# EasyEDA Pro project ProDocument_N64 SpyDVI_2024-08-21.epro

# Schematic Schematic
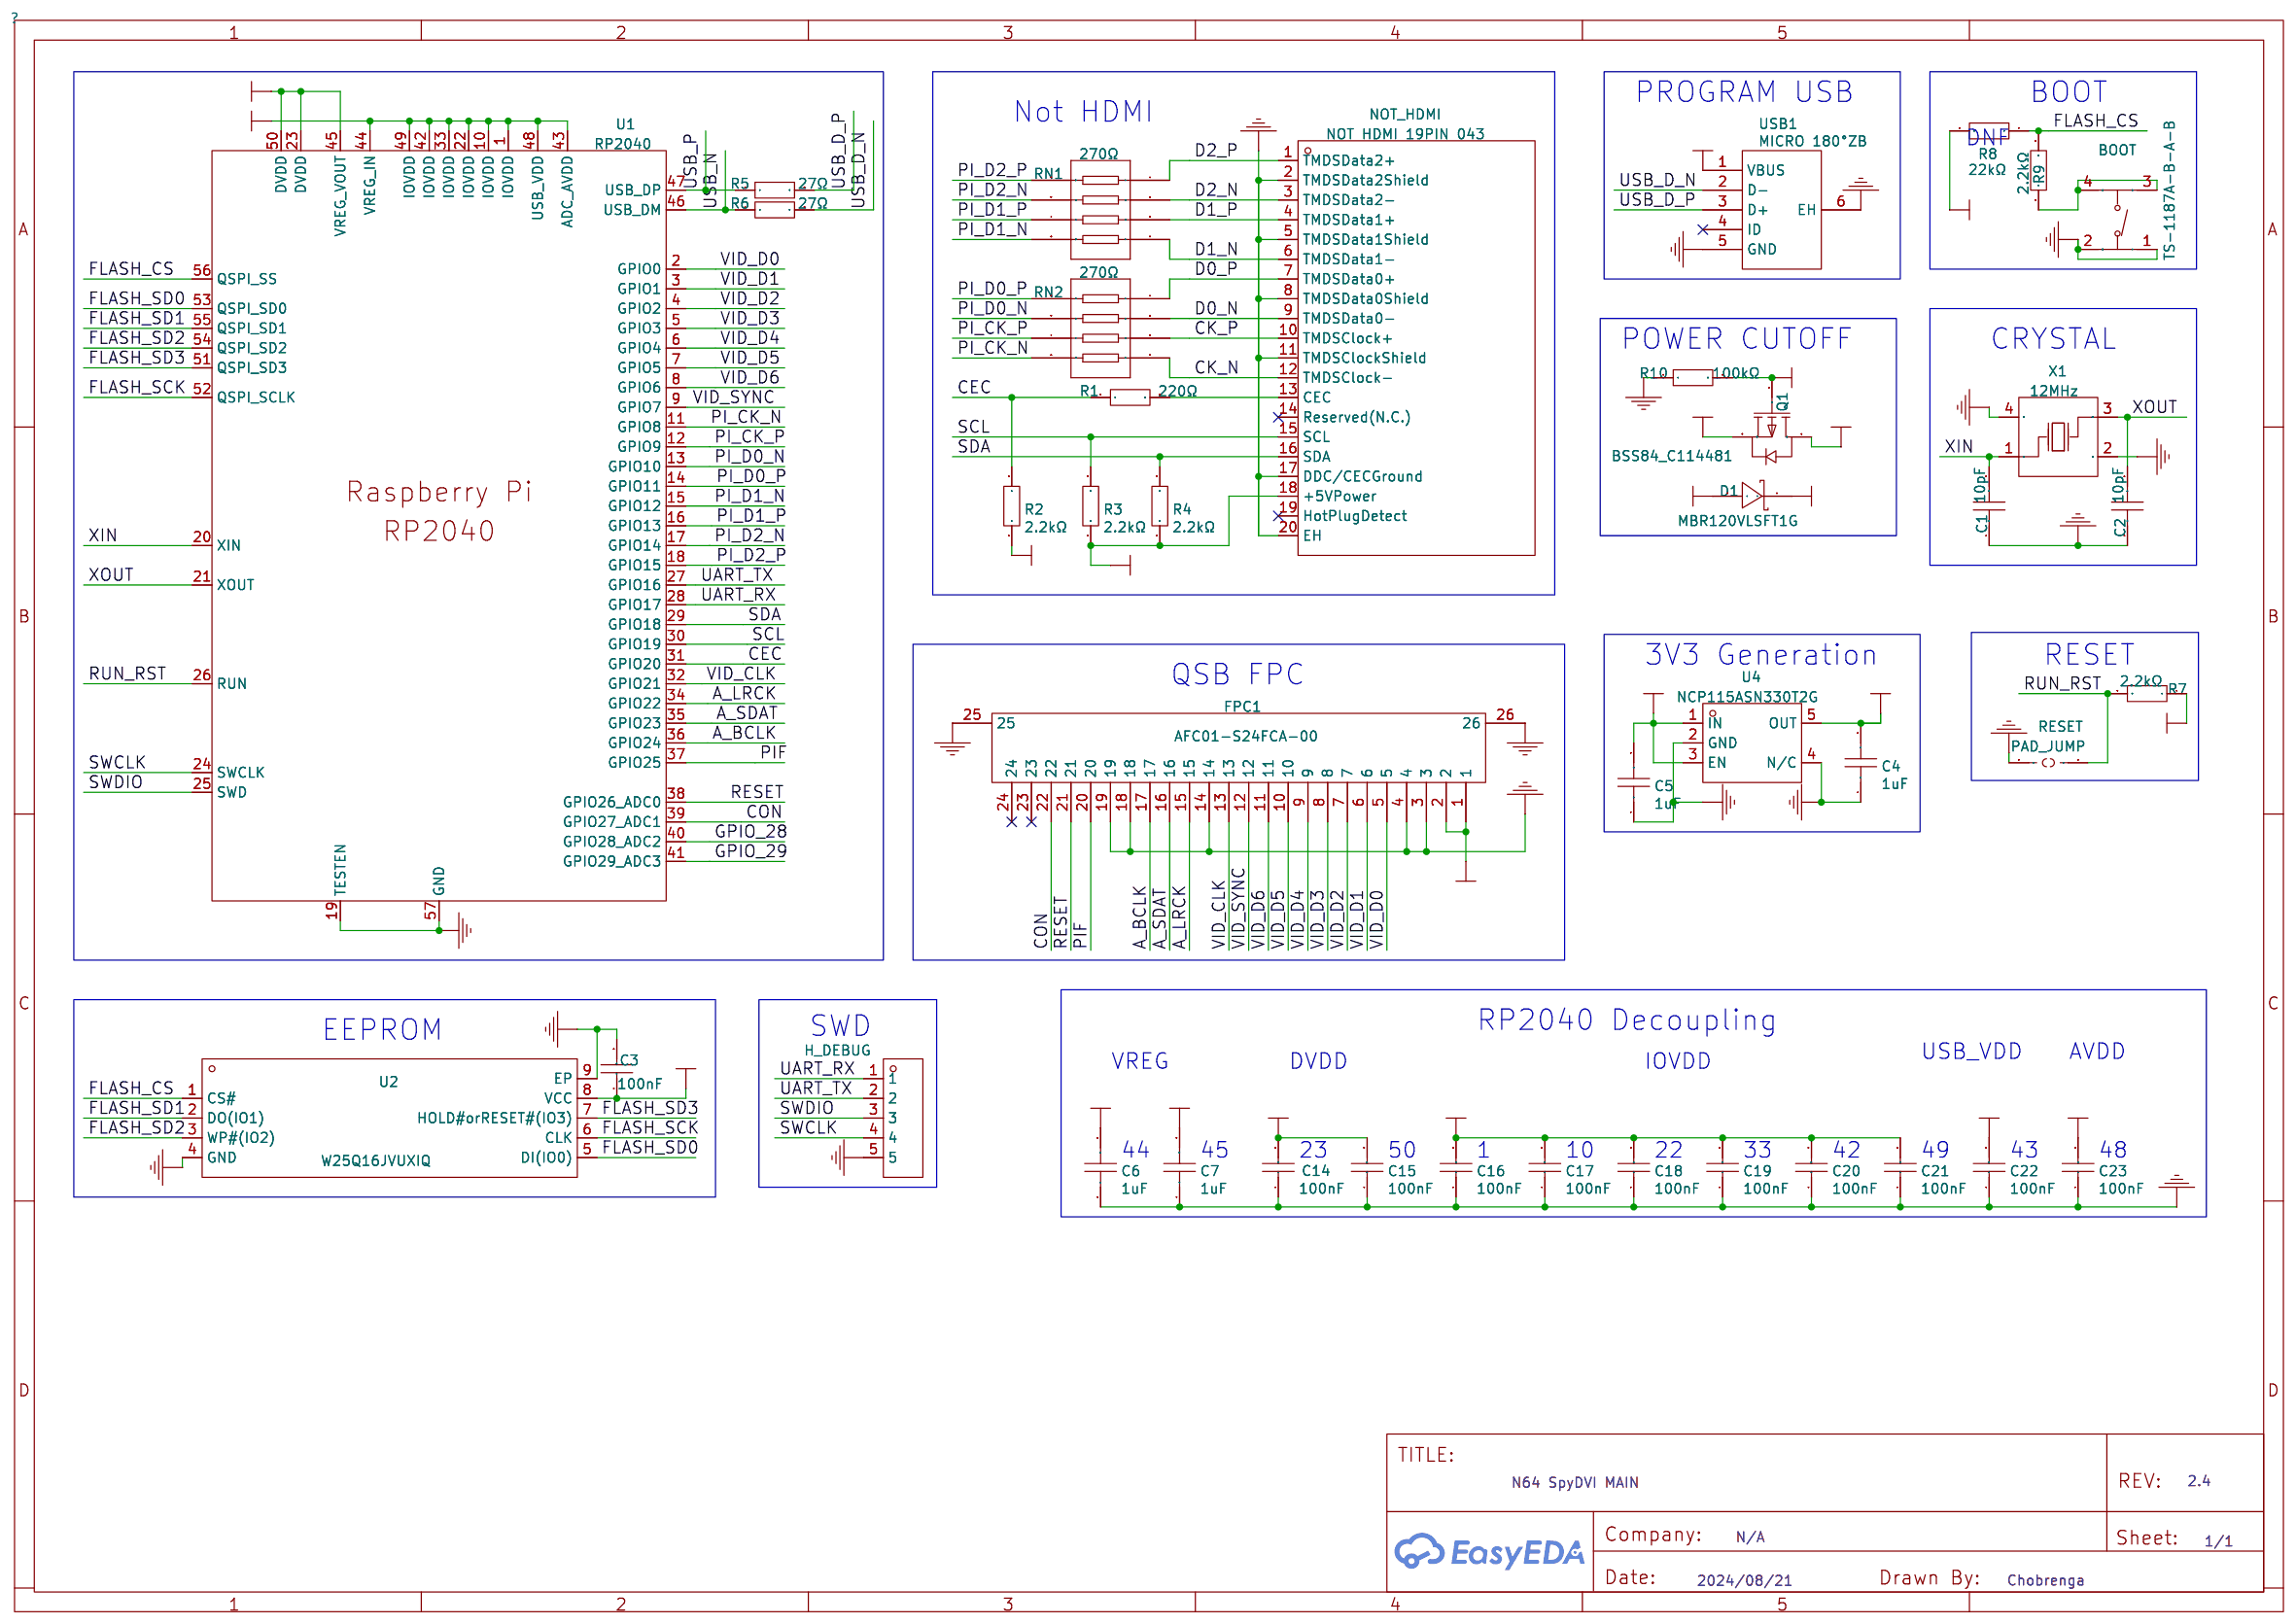
[diagram p0: schematic sheet]

## Parts
BOOT  TS-1187A-B-A-B  [SW-SMD_4P-L5.1-W5.1-P3.70-LS6.5-TL-2]
C1  10pF  [C0402]
C2  10pF  [C0402]
C3  100nF  [C0402]
C4  1uF  [C0402]
C5  1uF  [C0402]
C6  1uF  [C0402]
C7  1uF  [C0402]
C14  100nF  [C0402]
C15  100nF  [C0402]
C16  100nF  [C0402]
C17  100nF  [C0402]
C18  100nF  [C0402]
C19  100nF  [C0402]
C20  100nF  [C0402]
C21  100nF  [C0402]
C22  100nF  [C0402]
C23  100nF  [C0402]
D1  MBR120VLSFT1G  [SOD-123F_L2.8-W1.8-LS3.7-RD]
FPC1  AFC01-S24FCA-00  [FPC-SMD_P0.50-24P_FGS-XJ-H2.0]
H_DEBUG  PZ254V-11-05P  [HDR-TH_5P-P2.54-V-M]
NOT_HDMI  NOT HDMI 19PIN 043  [HDMI-SMD_HDMI-19PIN-043]
Q1  BSS84_C114481  [SOT-23-3_L2.9-W1.6-P1.90-LS2.8-BR]
R1  220Ω  [R0402]
R2  2.2kΩ  [R0402]
R3  2.2kΩ  [R0402]
R4  2.2kΩ  [R0402]
R5  27Ω  [R0402]
R6  27Ω  [R0402]
R7  2.2kΩ  [R0402]
R8  22kΩ  [R0402]  (no BOM)
R9  2.2kΩ  [R0402]
R10  100kΩ  [R0402]
RESET  PAD_JUMP  [PAD-JUMPER-2-NO_NO_SILK]  (no BOM)
RN1  270Ω  [RES-ARRAY-SMD_0804-8P-L2.0-W1.0-BL]
RN2  270Ω  [RES-ARRAY-SMD_0804-8P-L2.0-W1.0-BL]
U1  RP2040  [LQFN-56_L7.0-W7.0-P0.4-EP]
U2  W25Q16JVUXIQ  [USON-8_L3.0-W2.0-P0.50-BL-EP]
U4  NCP115ASN330T2G  [SOT-23-5_L3.0-W1.7-P0.95-LS2.8-BL]
USB1  MICRO 180°ZB  [MICRO-USB-TH_MICRO-180-ZB]
X1  12MHz  [CRYSTAL-SMD_4P-L3.2-W2.5-BL]

## Library data of the parts
BOOT = TS-1187A-B-A-B: Supplier: LCSC; Supplier Part: C318884; Manufacturer: XKB Connectivity(中国星坤); JLCPCB Part Class: Basic Part
C1 C2 = 10pF: Supplier: LCSC; Manufacturer: SAMSUNG(三星); Manufacturer Part: CL05C100JB5NNNC; Supplier Part: C32949; JLCPCB Part Class: Basic Part
C3 C14-C23 = 100nF: Supplier: LCSC; Manufacturer Part: CL05B104KO5NNNC; Manufacturer: SAMSUNG(三星); Supplier Part: C1525; JLCPCB Part Class: Basic Part
C4-C7 = 1uF: Supplier: LCSC; Manufacturer: SAMSUNG(三星); Manufacturer Part: CL05A105KA5NQNC; Supplier Part: C52923; JLCPCB Part Class: Basic Part
D1 = MBR120VLSFT1G: Supplier: LCSC; Supplier Part: C223608; Manufacturer: onsemi(安森美); JLCPCB Part Class: Extended Part
FPC1 = AFC01-S24FCA-00: Supplier: LCSC; Supplier Part: C262669; Manufacturer: JS(钜硕电子); JLCPCB Part Class: Extended Part
H_DEBUG = PZ254V-11-05P: Supplier: LCSC; Supplier Part: C492404; Manufacturer: XFCN(兴飞); JLCPCB Part Class: Extended Part
NOT_HDMI = NOT HDMI 19PIN 043: Supplier: LCSC; Supplier Part: C2858275; Manufacturer: SHOU HAN(首韩); Manufacturer Part: HDMI 19PIN 043; JLCPCB Part Class: Extended Part
Q1 = BSS84_C114481: Supplier: LCSC; Manufacturer: CJ(江苏长电/长晶); Manufacturer Part: BSS84; Supplier Part: C114481; JLCPCB Part Class: Extended Part
R1 = 220Ω: Supplier: LCSC; Manufacturer: UNI-ROYAL(厚声); Manufacturer Part: 0402WGF2200TCE; Supplier Part: C25091; JLCPCB Part Class: Basic Part
R2-R4 R7 R9 = 2.2kΩ: Supplier: LCSC; Manufacturer: UNI-ROYAL(厚声); Manufacturer Part: 0402WGF2201TCE; Supplier Part: C25879; JLCPCB Part Class: Basic Part
R5 R6 = 27Ω: Supplier: LCSC; Manufacturer: UNI-ROYAL(厚声); Manufacturer Part: 0402WGF270JTCE; Supplier Part: C25100; JLCPCB Part Class: Extended Part
R8 = 22kΩ
R10 = 100kΩ: Supplier: LCSC; Manufacturer: UNI-ROYAL(厚声); Manufacturer Part: 0402WGF1003TCE; Supplier Part: C25741; JLCPCB Part Class: Basic Part
RESET = PAD_JUMP
RN1 RN2 = 270Ω: Supplier: LCSC; Supplier Part: C148510; Manufacturer: BOURNS; Manufacturer Part: CAT10-271J4LF; JLCPCB Part Class: Extended Part
U1 = RP2040: Supplier: LCSC; Supplier Part: C2040; Manufacturer: Raspberry Pi(树莓派); JLCPCB Part Class: Extended Part
U2 = W25Q16JVUXIQ: Supplier: LCSC; Supplier Part: C2843335; Manufacturer: WINBOND(华邦); JLCPCB Part Class: Extended Part
U4 = NCP115ASN330T2G: Supplier: LCSC; Supplier Part: C603505; Manufacturer: onsemi(安森美); JLCPCB Part Class: Extended Part
USB1 = MICRO 180°ZB: Supplier: LCSC; Supplier Part: C668588; Manufacturer: SHOU HAN(首韩); JLCPCB Part Class: Extended Part
X1 = 12MHz: Supplier: LCSC; Manufacturer: YXC(扬兴晶振); Manufacturer Part: X322512MMB4SI; Supplier Part: C50430; JLCPCB Part Class: Extended Part

## Nets
+1V1: C7.2 C14.2 C15.2 U1.23(DVDD) U1.45(VREG_VOUT) U1.50(DVDD)
+3V3: C3.1 C4.2 C6.2 C16.2 C17.2 C18.2 C19.2 C20.2 C21.2 C22.2 C23.2 R2.1 R7.1 R8.2 U1.1(IOVDD) U1.10(IOVDD) U1.22(IOVDD) U1.33(IOVDD) U1.42(IOVDD) U1.43(ADC_AVDD) U1.44(VREG_IN) U1.48(USB_VDD) U1.49(IOVDD) U2.8(VCC) U4.5(OUT)
+5V_N64: FPC1.1 FPC1.2 Q1.3(D)
+VBUS: D1.2(A) Q1.1(G) R10.2 USB1.1(VBUS)
GND: BOOT.1(A) BOOT.2(B) C1.1 C2.1 C3.2 C4.1 C5.1 C6.1 C7.1 C14.1 C15.1 C16.1 C17.1 C18.1 C19.1 C20.1 C21.1 C22.1 C23.1 FPC1.3 FPC1.4 FPC1.14 FPC1.18 FPC1.19 FPC1.25 FPC1.26 H_DEBUG.5 NOT_HDMI.2(TMDSData2Shield) NOT_HDMI.5(TMDSData1Shield) NOT_HDMI.8(TMDSData0Shield) NOT_HDMI.11(TMDSClockShield) NOT_HDMI.17(DDC/CECGround) NOT_HDMI.20(EH) R10.1 RESET.1 U1.19(TESTEN) U1.57(GND) U2.4(GND) U2.9(EP) U4.2(GND) U4.4(N/C) USB1.5(GND) USB1.6(EH) X1.2(GND) X1.4(GND)
+VSYS: C5.2 D1.1(K) NOT_HDMI.18(+5VPower) Q1.2(S) R3.1 R4.1 U4.1(IN) U4.3(EN)
A_BCLK: FPC1.17 U1.36(GPIO24)
A_LRCK: FPC1.15 U1.34(GPIO22)
A_SDAT: FPC1.16 U1.35(GPIO23)
CEC: R1.1 R2.2 U1.31(GPIO20)
CK_N: NOT_HDMI.12(TMDSClock-) RN2.1
CK_P: NOT_HDMI.10(TMDSClock+) RN2.2
CON: FPC1.22 U1.39(GPIO27_ADC1)
D0_N: NOT_HDMI.9(TMDSData0-) RN2.3
D0_P: NOT_HDMI.7(TMDSData0+) RN2.4
D1_N: NOT_HDMI.6(TMDSData1-) RN1.1
D1_P: NOT_HDMI.4(TMDSData1+) RN1.2
D2_N: NOT_HDMI.3(TMDSData2-) RN1.3
D2_P: NOT_HDMI.1(TMDSData2+) RN1.4
FLASH_CS: R8.1 R9.2 U1.56(QSPI_SS) U2.1(CS#)
FLASH_SCK: U1.52(QSPI_SCLK) U2.6(CLK)
FLASH_SD0: U1.53(QSPI_SD0) U2.5(DI(IO0))
FLASH_SD1: U1.55(QSPI_SD1) U2.2(DO(IO1))
FLASH_SD2: U1.54(QSPI_SD2) U2.3(WP#(IO2))
FLASH_SD3: U1.51(QSPI_SD3) U2.7(HOLD#orRESET#(IO3))
GPIO_28: U1.40(GPIO28_ADC2)
GPIO_29: U1.41(GPIO29_ADC3)
PI_CK_N: RN2.8 U1.11(GPIO8)
PI_CK_P: RN2.7 U1.12(GPIO9)
PI_D0_N: RN2.6 U1.13(GPIO10)
PI_D0_P: RN2.5 U1.14(GPIO11)
PI_D1_N: RN1.8 U1.15(GPIO12)
PI_D1_P: RN1.7 U1.16(GPIO13)
PI_D2_N: RN1.6 U1.17(GPIO14)
PI_D2_P: RN1.5 U1.18(GPIO15)
PIF: FPC1.20 U1.37(GPIO25)
RESET: FPC1.21 U1.38(GPIO26_ADC0)
RUN_RST: R7.2 RESET.2 U1.26(RUN)
SCL: NOT_HDMI.15(SCL) R3.2 U1.30(GPIO19)
SDA: NOT_HDMI.16(SDA) R4.2 U1.29(GPIO18)
SWCLK: H_DEBUG.4 U1.24(SWCLK)
SWDIO: H_DEBUG.3 U1.25(SWD)
UART_RX: H_DEBUG.1 U1.28(GPIO17)
UART_TX: H_DEBUG.2 U1.27(GPIO16)
USB_D_N: R6.2 USB1.2(D-)
USB_D_P: R5.2 USB1.3(D+)
USB_N: R6.1 U1.46(USB_DM)
USB_P: R5.1 U1.47(USB_DP)
VID_CLK: FPC1.13 U1.32(GPIO21)
VID_D0: FPC1.5 U1.2(GPIO0)
VID_D1: FPC1.6 U1.3(GPIO1)
VID_D2: FPC1.7 U1.4(GPIO2)
VID_D3: FPC1.8 U1.5(GPIO3)
VID_D4: FPC1.9 U1.6(GPIO4)
VID_D5: FPC1.10 U1.7(GPIO5)
VID_D6: FPC1.11 U1.8(GPIO6)
VID_SYNC: FPC1.12 U1.9(GPIO7)
XIN: C1.2 U1.20(XIN) X1.1(OSC1)
XOUT: C2.2 U1.21(XOUT) X1.3(OSC2)
NOT_HDMI_13: NOT_HDMI.13(CEC) R1.2
R9_1: BOOT.3(C) BOOT.4(D) R9.1

Not connected (* = marked no-connect by the designer): FPC1 23* 24*; NOT_HDMI 14(Reserved(N.C.))* 19(HotPlugDetect)*; USB1 4(ID)*

## Notes on the sheet
- Not HDMI
- PROGRAM USB
- BOOT
- DNF
- POWER CUTOFF
- CRYSTAL
- 3V3 Generation
- RESET
- QSB FPC
- RP2040 Decoupling
- EEPROM
- SWD
- VREG
- DVDD
- IOVDD
- USB_VDD
- AVDD
- 44
- 45
- 23
- 50
- 1
- 10
- 22
- 33
- 42
- 49
- 43
- 48

# Board N64 SpyDVI
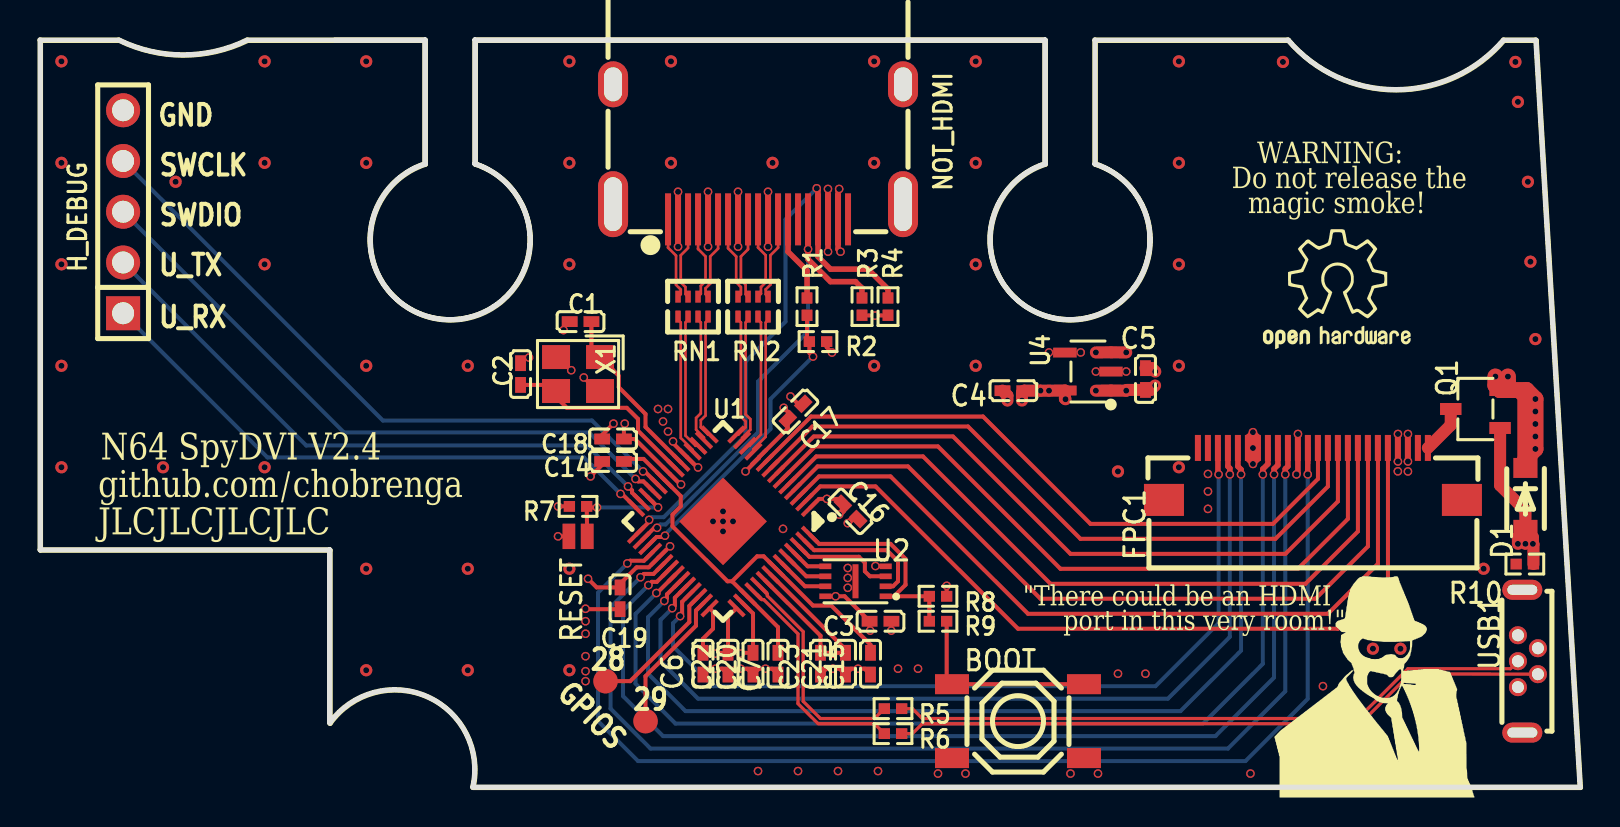
[diagram p1: board, top side]
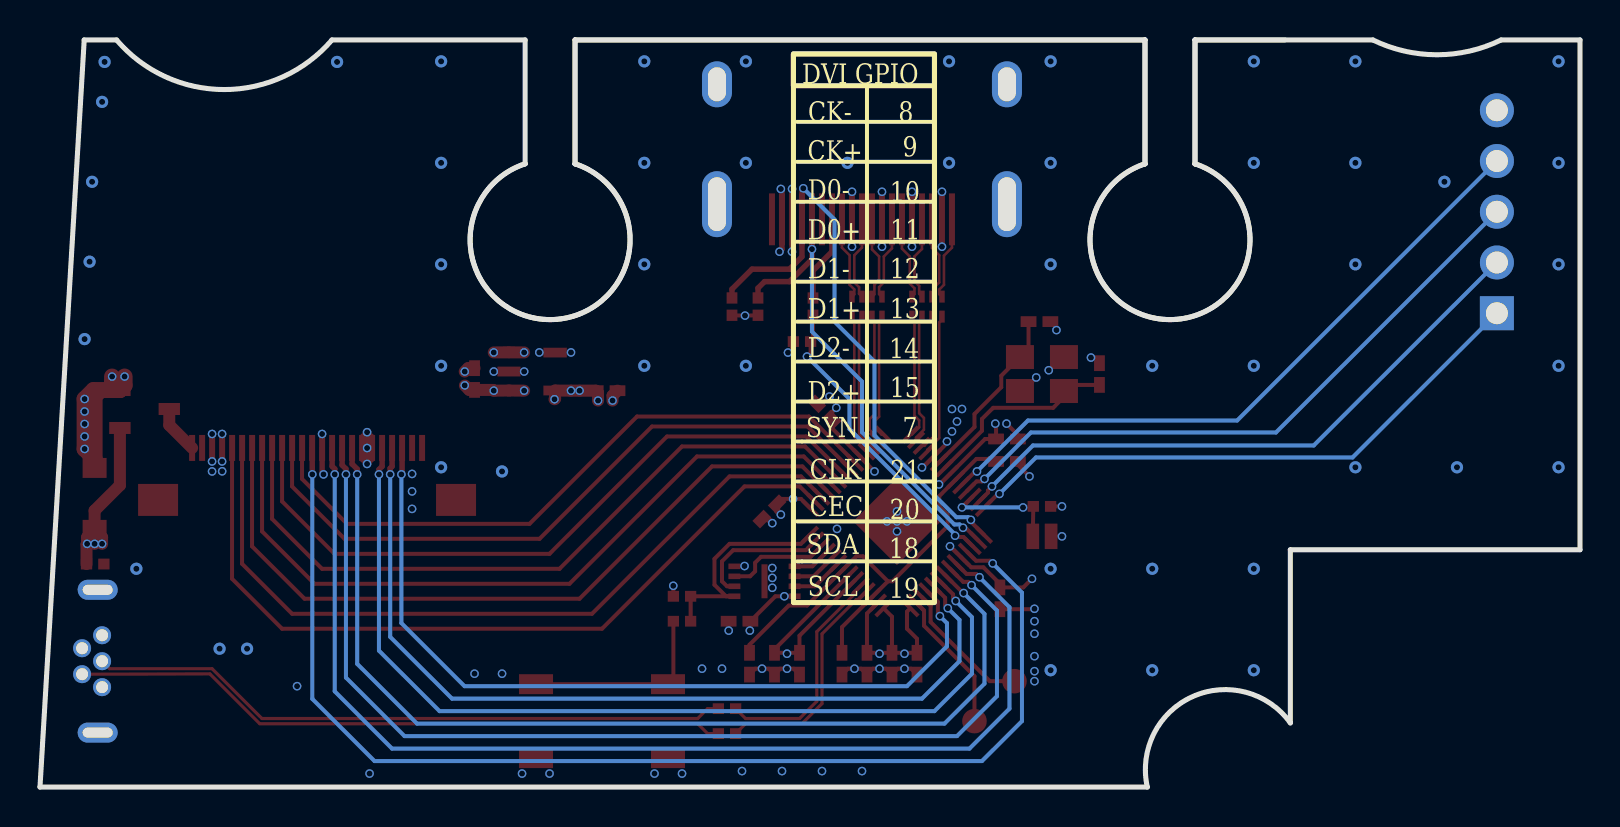
[diagram p2: board, bottom side, seen from below]

Outline 77.01 x 37.4 mm; copper layers: Top Layer, GNDLayer, PowerLayer, Bottom Layer. Coordinates in mm from the lower left corner of the outline.
Outline path: 19.25,31.2 19.25,37.4 10.36,37.4 arc(7.15,36.66) 3.94,37.4 0,37.4 0,11.88 14.48,11.88 14.48,3.21 arc(19.37,4.53) 21.64,0 77.01,0 74.8,37.4 73.18,37.4 arc(67.8,34.92) 62.41,37.4 52.75,37.4 52.75,31.2 ; 19.25,31.2 19.25,31.2 19.25,31.2 ; 19.25,31.2 arc(20.5,23.4) 21.75,31.2 ; 14.76,37.4 19.26,37.4 19.26,31.2 arc(20.51,23.4) 21.76,31.2 ; 21.75,31.2 21.75,37.4 50.25,37.4 50.25,31.2 ; 21.75,31.2 21.76,31.2 ; 21.75,31.2 21.76,31.2 ; 21.76,31.2 21.76,37.4 50.26,37.4 50.26,31.2 ; 50.25,31.2 50.26,31.2 ; 50.25,31.2 50.26,31.2 ; 50.25,31.2 arc(51.5,23.4) 52.75,31.2 ; 50.26,31.2 arc(51.51,23.4) 52.76,31.2 52.75,31.2
Stack: Top Layer 0.035mm / Dielectric1 0.48mm PP er 4.5 / GNDLayer 0.035mm / Dielectric2 0.48mm FR4 er 4.5 / PowerLayer 0.035mm / Dielectric3 0.48mm PP er 4.5 / Bottom Layer 0.035mm

## Design rules (mm)
template: User Custom Config
spacing Default (default): track to track 0.099, other pairs 0 to 0.099
spacing 50ohm: track to track 0.099, other pairs 0 to 0.099
spacing 50ohm2: track to track 0.102, other pairs 0 to 0.102
spacing 90ohm: track to track 0.099, other pairs 0 to 0.099
spacing 90ohm2: track to track 0.099, other pairs 0 to 0.099
spacing 95ohm: track to track 0.089, other pairs 0 to 0.089
spacing 95ohm2: track to track 0.102, other pairs 0 to 0.102
track width Default (default): min 0.201, default 0.201, max 25.4
track width 50ohm: min 0.287, default 0.287, max 25.4
track width 50ohm2: min 0.3, default 0.3, max 25.4
track width 90ohm: min 0.183, default 0.183, max 25.4
track width 90ohm2: min 0.16, default 0.16, max 25.4
track width 95ohm: min 0.155, default 0.155, max 25.4
track width 95ohm2: min 0.132, default 0.132, max 25.4
differential pair differentialPair (default): width min 0.127, default 0.254, max 2.54; gap min 0.152, default 0.152
via Default (default): diameter min 0.429, default 0.429, max 100.025; hole min 0.3, default 0.3, max 59.995
via 50ohm: diameter min 0.429, default 0.429, max 100.025; hole min 0.3, default 0.3, max 59.995
via 50ohm2: diameter min 0.429, default 0.429, max 100.025; hole min 0.3, default 0.3, max 59.995
via 90ohm: diameter min 0.429, default 0.429, max 100.025; hole min 0.3, default 0.3, max 59.995
via 90ohm2: diameter min 0.429, default 0.429, max 100.025; hole min 0.3, default 0.3, max 59.995
via 95ohm: diameter min 0.429, default 0.429, max 100.025; hole min 0.3, default 0.3, max 59.995
via 95ohm2: diameter min 0.429, default 0.429, max 100.025; hole min 0.3, default 0.3, max 59.995
net USB_D_N uses 90ohm2
net USB_D_P uses 90ohm2
net USB_N uses 90ohm2
net USB_P uses 90ohm2
net D0_P uses 95ohm2
net D0_N uses 95ohm2
net D2_P uses 95ohm2
net D2_N uses 95ohm2
net D1_P uses 95ohm2
net D1_N uses 95ohm2
net CK_P uses 95ohm2
net CK_N uses 95ohm2
net PI_D1_P uses 95ohm2
net PI_D1_N uses 95ohm2
net PI_D2_N uses 95ohm2
net PI_D2_P uses 95ohm2
net PI_D0_P uses 95ohm2
net PI_D0_N uses 95ohm2
net PI_CK_N uses 95ohm2
net PI_CK_P uses 95ohm2
net GND uses TGND
net +VSYS uses 5VPlane
net +3V3 uses 3V3Plane
net +VBUS uses gge101704
net +5V_N64 uses gge100470
pour e74 uses BGND
pour e120 uses 5VPlane
pour e121 uses 3V3Plane
pour e122 uses gge101704
pour e123 uses gge104810
pour e619 uses TGND
pour e620 uses gge100470

## Placement (name value [footprint] x y rotation side)
BOOT  TS-1187A-B-A-B  [SW-SMD_4P-L5.1-W5.1-P3.70-LS6.5-TL-2]  48.91 3.3 180 top
C1  10pF  [C0402]  27.03 23.3 0 top
C2  10pF  [C0402]  24.03 20.67 270 top
C3  100nF  [C0402]  42.03 8.3 0 top
C4  1uF  [C0402]  48.68 19.84 0 top
C5  1uF  [C0402]  55.28 20.42 270 top
C6  1uF  [C0402]  33.16 6.17 90 top
C7  1uF  [C0402]  36.91 6.17 90 top
C14  100nF  [C0402]  28.66 16.3 0 top
C15  100nF  [C0402]  41.53 6.17 90 top
C16  100nF  [C0402]  40.53 13.8 135 top
C17  100nF  [C0402]  37.78 18.8 225 top
C18  100nF  [C0402]  28.66 17.42 0 top
C19  100nF  [C0402]  29.01 9.45 90 top
C20  100nF  [C0402]  35.66 6.17 90 top
C21  100nF  [C0402]  40.28 6.17 90 top
C22  100nF  [C0402]  34.41 6.17 90 top
C23  100nF  [C0402]  39.03 6.17 90 top
D1  MBR120VLSFT1G  [SOD-123F_L2.8-W1.8-LS3.7-RD]  74.28 14.42 270 top
FPC1  AFC01-S24FCA-00  [FPC-SMD_P0.50-24P_FGS-XJ-H2.0]  63.66 15.67 180 top
H_DEBUG  PZ254V-11-05P  [HDR-TH_5P-P2.54-V-M]  4.16 28.8 90 top
NOREF  -  [Pad_e617]  28.28 5.3 0 top
NOREF#2  -  [Pad_e618]  30.28 3.3 0 top
NOT_HDMI  NOT HDMI 19PIN 043  [HDMI-SMD_HDMI-19PIN-043]  35.91 31.8 180 top
Q1  BSS84_C114481  [SOT-23-3_L2.9-W1.6-P1.90-LS2.8-BR]  71.78 18.92 0 top
R1  220Ω  [R0402]  38.36 24.05 90 top
R2  2.2kΩ  [R0402]  38.91 22.3 180 top
R3  2.2kΩ  [R0402]  41.11 24.05 90 top
R4  2.2kΩ  [R0402]  42.41 24.05 90 top
R5  27Ω  [R0402]  42.66 3.92 0 top
R6  27Ω  [R0402]  42.66 2.67 0 top
R7  2.2kΩ  [R0402]  26.91 14.05 0 top
R8  22kΩ  [R0402]  44.91 9.55 0 top
R9  2.2kΩ  [R0402]  44.91 8.3 180 top
R10  100kΩ  [R0402]  74.25 11.16 0 top
RESET  PAD_JUMP  [PAD-JUMPER-2-NO_NO_SILK]  26.91 12.55 0 top
RN1  270Ω  [RES-ARRAY-SMD_0804-8P-L2.0-W1.0-BL]  32.66 24.05 180 top
RN2  270Ω  [RES-ARRAY-SMD_0804-8P-L2.0-W1.0-BL]  35.66 24.05 180 top
U1  RP2040  [LQFN-56_L7.0-W7.0-P0.4-EP]  34.16 13.3 225 top
U2  W25Q16JVUXIQ  [USON-8_L3.0-W2.0-P0.50-BL-EP]  40.78 10.3 90 top
U4  NCP115ASN330T2G  [SOT-23-5_L3.0-W1.7-P0.95-LS2.8-BL]  52.41 20.8 90 top
USB1  MICRO 180°ZB  [MICRO-USB-TH_MICRO-180-ZB]  74.41 6.3 90 top
X1  12MHz  [CRYSTAL-SMD_4P-L3.2-W2.5-BL]  26.91 20.67 180 top

## Footprints (pads in the part's own frame, mm; a bottom-side part is the same pattern mirrored in y, then rotated)
C0402
  rect 0.79x0.54 smd: 1(-0.545,0) 2(0.545,0)
CRYSTAL-SMD_4P-L3.2-W2.5-BL
  rect 1.4x1.2 smd: 1(-1.1,-0.85) 2(1.1,-0.85) 3(1.1,0.85) 4(-1.1,0.85)
FPC-SMD_P0.50-24P_FGS-XJ-H2.0
  rect 0.3x1.3 smd: 1(-5.748,-1.3) 2(-5.248,-1.3) 3(-4.748,-1.3) 4(-4.248,-1.3) 5(-3.748,-1.3) 6(-3.248,-1.3) 7(-2.748,-1.3) 8(-2.248,-1.3) 9(-1.748,-1.3) 10(-1.248,-1.3) 11(-0.748,-1.3) 12(-0.248,-1.3) 13(0.252,-1.3) 14(0.752,-1.3) 15(1.252,-1.3) 16(1.752,-1.3) 17(2.252,-1.3) 18(2.752,-1.3) 19(3.252,-1.3) 20(3.752,-1.3) 21(4.252,-1.3) 22(4.752,-1.3) 23(5.252,-1.3) 24(5.752,-1.3)
  rect 2x1.6 smd: 25(7.45,1.301) 26(-7.45,1.301)
HDMI-SMD_HDMI-19PIN-043
  rect 0.3x2.6 smd: 1(4.5,3.38) 2(4,3.38) 3(3.5,3.38) 4(3,3.38) 5(2.5,3.38) 6(2,3.38) 7(1.5,3.38) 8(1,3.38) 9(0.5,3.38) 10(0,3.38) 11(-0.5,3.38) 12(-1,3.38) 13(-1.5,3.38) 14(-2,3.38) 15(-2.5,3.38) 16(-3,3.38) 17(-3.5,3.38) 18(-4,3.38) 19(-4.5,3.38)
  oval 1.5x3.3 hole 0.9x2.7: 20(-7.25,2.62) 23(7.25,2.62)
  oval 1.5x2.3 hole 0.9x1.7: 21(-7.25,-3.38) 22(7.25,-3.38)
HDR-TH_5P-P2.54-V-M
  rect 1.7x1.7 hole 1.1: 1(-5.08,0)
  round 1.7 hole 1.1: 2(-2.54,0) 3(0,0) 4(2.54,0) 5(5.08,0)
LQFN-56_L7.0-W7.0-P0.4-EP
  rect 1.1x0.2 smd: 1(-3.55,2.6) 2(-3.55,2.2) 3(-3.55,1.8) 4(-3.55,1.4) 5(-3.55,1) 6(-3.55,0.6) 7(-3.55,0.2) 8(-3.55,-0.2) 9(-3.55,-0.6) 10(-3.55,-1) 11(-3.55,-1.4) 12(-3.55,-1.8) 13(-3.55,-2.2) 14(-3.55,-2.6) 29(3.55,-2.6) 30(3.55,-2.2) 31(3.55,-1.8) 32(3.55,-1.4) 33(3.55,-1) 34(3.55,-0.6) 35(3.55,-0.2) 36(3.55,0.2) 37(3.55,0.6) 38(3.55,1) 39(3.55,1.4) 40(3.55,1.8) 41(3.55,2.2) 42(3.55,2.6)
  rect 0.2x1.1 smd: 15(-2.6,-3.55) 16(-2.2,-3.55) 17(-1.8,-3.55) 18(-1.4,-3.55) 19(-1,-3.55) 20(-0.6,-3.55) 21(-0.2,-3.55) 22(0.2,-3.55) 23(0.6,-3.55) 24(1,-3.55) 25(1.4,-3.55) 26(1.8,-3.55) 27(2.2,-3.55) 28(2.6,-3.55) 43(2.6,3.55) 44(2.2,3.55) 45(1.8,3.55) 46(1.4,3.55) 47(1,3.55) 48(0.6,3.55) 49(0.2,3.55) 50(-0.2,3.55) 51(-0.6,3.55) 52(-1,3.55) 53(-1.4,3.55) 54(-1.8,3.55) 55(-2.2,3.55) 56(-2.6,3.55)
  rect 3.1x3.1 smd: 57(0,0)
MICRO-USB-TH_MICRO-180-ZB
  round 0.9 hole 0.6: 1(-1.3,0.5) 2(-0.65,-0.5) 3(0,0.5) 4(0.65,-0.5) 5(1.3,0.5)
  oval 1x2 hole 0.5x1.5: 6(3.575,0.28) 7(-3.575,0.28)
PAD-JUMPER-2-NO_NO_SILK
  rect 0.635x1.27 smd: 1(-0.457,0) 2(0.457,0)
Pad_e617
  round 1.23 smd: 7(0,0)
Pad_e618
  round 1.23 smd: 10(0,0)
R0402
  rect 0.566x0.54 smd: 1(-0.433,0) 2(0.432,0)
RES-ARRAY-SMD_0804-8P-L2.0-W1.0-BL
  rect 0.275x0.6 smd: 1(-0.75,-0.5) 2(-0.249,-0.5) 3(0.25,-0.5) 4(0.75,-0.5) 5(0.75,0.5) 6(0.25,0.5) 7(-0.249,0.5) 8(-0.75,0.5)
SOD-123F_L2.8-W1.8-LS3.7-RD
  rect 1x1.2 smd: 1(-1.55,0) 2(1.55,0)
SOT-23-3_L2.9-W1.6-P1.90-LS2.8-BR
  rect 1.07x0.6 smd: 1(1.235,-0.95) 2(1.235,0.95) 3(-1.235,0)
SOT-23-5_L3.0-W1.7-P0.95-LS2.8-BL
  rect 0.49x1.157 smd: 1(-0.95,-1.153) 2(0,-1.153) 3(0.95,-1.153)
  rect 0.49x1.175 smd: 4(0.95,1.154) 5(-0.95,1.154)
SW-SMD_4P-L5.1-W5.1-P3.70-LS6.5-TL-2
  rect 1.7x1 smd: 1(-3.3,1.85) 2(3.3,1.85) 3(-3.3,-1.85) 4(3.3,-1.85)
USON-8_L3.0-W2.0-P0.50-BL-EP
  rect 0.28x0.6 smd: 1(-0.75,-1.508) 2(-0.25,-1.508) 3(0.25,-1.508) 4(0.75,-1.508) 5(0.75,1.508) 6(0.25,1.508) 7(-0.25,1.508) 8(-0.75,1.508)
  rect 1.7x0.3 smd: 9(0,0)

## Nets
As in the schematic, except:
GND: BOOT.1 BOOT.2 C1.1 C2.1 C3.2 C4.1 C5.1 C6.1 C7.1 C14.1 C15.1 C16.1 C17.1 C18.1 C19.1 C20.1 C21.1 C22.1 C23.1 FPC1.3 FPC1.4 FPC1.14 FPC1.18 FPC1.19 FPC1.25 FPC1.26 H_DEBUG.5 NOT_HDMI.2 NOT_HDMI.5 NOT_HDMI.8 NOT_HDMI.11 NOT_HDMI.17 NOT_HDMI.20 NOT_HDMI.21 NOT_HDMI.22 NOT_HDMI.23 R10.1 RESET.1 U1.19 U1.57 U2.4 U2.9 U4.2 U4.4 USB1.5 USB1.6 USB1.7 X1.2 X1.4
GPIO_28: NOREF.7 U1.40
GPIO_29: NOREF#2.10 U1.41

Pads without a net: FPC1 23 24; NOT_HDMI 14 19; USB1 4

## Via types
v1: diameter 0.43, hole 0.3, Top Layer to Bottom Layer, 145 vias
v2: diameter 0.61, hole 0.305, Top Layer to Bottom Layer, 49 vias

## Routing (per net, layer and track width the routed paths; a pad name or vN(x,y) marks a point on that pad's centre or on a via; arc(x,y) is an arc through that point)
+1V1: length 23.8
  Top Layer w0.2: 35.39,9.52 34.61,10.3 ; 34.61,10.3 35.86,11.55 36.19,11.55 U1.50 38.65,9.09 39.57,9.09 41.53,7.12 41.53,6.72 ; 34.61,10.3 34.38,10.3 31.63,13.05 31.63,13.64 32.04,14.05 32.04,14.56 31.22,15.38 30.18,16.43 29.2,16.43 29.2,16.3 ; C7.2 36.91,8 U1.45
+3V3: length 46.3
  Top Layer w0.2: C22.2 34.41,8.53 U1.43 ; C22.2 33.83,6.72 v1(33.78,6.67) 33.74,6.72 C6.2 ; C22.2 34.99,6.72 v1(35.03,6.67) 35.08,6.72 C20.2 35.66,8.69 U1.44 ; v1(37.19,18.98) 37.39,18.78 C17.2 37.39,17.95 U1.10 35.96,16.48 v1(35.28,15.8) ; 25.91,14.05 26.47,14.05 ; U1.22 29.75,17.42 C18.2 29.2,18.16 v1(29.24,18.19) ; v1(39.61,21.75) 39.34,22.02 39.34,22.3 ; U1.48 39.03,7.58 C23.2 39.61,6.72 v1(39.66,6.67) 39.7,6.72 C21.2 40.28,6.89 U1.49 ; C16.2 39.91,14.42 v1(39.35,14.42) 38.96,14.42 38.5,13.97 ; U2.8 v1(39.79,9.55) 40.24,9.55 C3.1 41.49,7.86 v1(41.51,7.83) ; v1(45.34,10.08) 45.34,9.55 ; 31.5,15.67 32.02,15.15 32.05,15.15 ; v1(31.51,12.05) 31.49,12.05 30.44,11 29.83,11 29.01,10.18 C19.2 27.84,9.99 v1(27.41,10.42) ; 33.48,8.95 33.66,8.78 33.66,7.92 33.15,7.42 33.15,6.72
  Top Layer w0.3: C16.2 40.14,13.82 v1(39.96,13.64)
  Top Layer w0.6: v1(50.46,19.84) v1(50.03,19.84) C4.2 49.1,19.73 v1(49.1,19.35) ; 50.46,19.84 U4.5 51.25,19.44 v1(51.28,19.41)
  vias: v1(25.91,14.05) v1(32.06,15.15)
+5V_N64: length 2.4
  Top Layer w0.6: Q1.3 70.55,18.12 FPC1.1
+VBUS: length 9.1
  Top Layer w0.6: v1(73.91,12.17) 73.91,12.5 D1.2 ; R10.2 74.68,12.15 v1(74.66,12.17) 74.66,12.5 D1.2 ; D1.2 v1(74.28,12.17) ; 74.28,12.88 74.28,13.84 73.02,15.11 Q1.1
GND: length 28.9
  Top Layer w0.2: C17.1 37.89,19.19 v1(37.53,19.55) ; C15.1 41.24,5.92 v1(40.91,5.92) 40.58,5.92 C21.1 39.99,5.92 v1(39.66,5.92) 39.33,5.92 C23.1 ; v1(32.91,16) 32.87,16 U1.19 31.66,17.22 v1(31.66,17.3) ; v1(27.53,15.55) 28.11,16.13 C14.1 ; C18.1 28.11,17.63 v1(28.68,18.19) ; C6.1 33.45,5.92 v1(33.78,5.92) 34.11,5.92 C22.1 34.7,5.92 v1(35.03,5.92) 35.36,5.92 C20.1 35.95,5.92 v1(36.28,5.92) 36.61,5.92 C7.1 ; v1(42.57,7.83) C3.2 ; v1(41.78,11.06) 42.29,11.05 ; v1(26.57,20.87) 25.91,21.52 X1.2 ; v1(27.19,20.5) 27.87,19.83 X1.4 ; v1(27.28,8.92) 27.3,8.9 C19.1 ; v1(25.91,12.55) RESET.1
  Top Layer w0.275: v1(39.41,26.8) NOT_HDMI.17 39.4,29.94 ; v1(60.66,16.17) 60.9,16.42 FPC1.18 60.9,17.52 v1(60.65,17.76) 60.4,17.51 FPC1.19 60.4,16.43 v1(60.66,16.17) ; v1(60.66,16.17) 60.66,17.77 ; v1(62.83,15.65) 62.9,15.72 FPC1.14
  Top Layer w0.3: v1(40.39,13.21) 40.6,13.41 40.92,13.41
  Top Layer w0.6: C5.1 55.6,20.97 v1(55.77,20.8) ; v1(48.38,19.35) 48.38,19.59 48.13,19.84
  vias: v1(24.46,21.5) v1(26.18,22.88) v1(27.28,8.3) v1(27.28,7.67) v1(27.28,6.55) v1(27.28,5.8) v1(27.28,5.3) v1(30.91,18.92) v1(31.16,18.3) v1(31.41,18.92) v1(31.41,17.8) v1(31.91,29.8) v1(31.91,27.05) v1(33.41,29.8) v1(33.41,27.05) v1(33.66,13.3) v1(34.16,13.8) v1(34.16,13.3) v1(34.16,12.8) v1(34.66,13.3) v1(34.91,29.8) v1(34.91,27.05) v1(35.91,0.8) v1(36.41,29.8) v1(36.41,27.05) v1(37.16,12.92) v1(37.91,0.8) v1(39.4,29.94) v1(39.91,0.8) v1(40.39,10.97) v1(40.39,10.47) v1(40.39,9.98) v1(41.91,0.8) v1(42.91,5.92) v1(43.91,5.92) v1(44.91,0.67) v1(46.28,0.67) v1(50.46,21.76) v1(51.53,0.67) v1(52.04,21.76) v1(52.8,20.8) v1(52.91,0.67) v1(53.91,5.67) v1(54.32,20.8) v1(55.28,5.67) v1(58.41,15.67) v1(58.41,14.8) v1(58.41,13.92) v1(60.53,0.67) v1(60.65,16.97) v1(62.91,17.67) v1(64.16,5.05) v1(67.91,17.67) v1(67.91,16.3) v1(67.9,15.81) v1(68.41,17.67) v1(68.41,16.3) v1(68.41,15.8) v2(1.07,36.33) v2(1.07,31.25) v2(1.07,26.17) v2(1.07,21.09) v2(1.07,16.01) v2(6.15,16.01) v2(6.78,30.3) v2(11.23,36.33) v2(11.23,31.25) v2(11.23,26.17) v2(11.23,16.01) v2(16.31,36.33) v2(16.31,31.25) v2(16.31,21.09) v2(16.31,10.93) v2(16.31,5.85) v2(21.39,21.09) v2(21.39,10.93) v2(21.39,5.85) v2(26.47,36.33) v2(26.47,31.25) v2(26.47,26.17) v2(26.47,10.93) v2(26.47,5.85) v2(31.55,36.33) v2(31.55,31.25) v2(36.63,31.25) v2(41.71,36.33) v2(41.71,31.25) v2(41.71,21.09) v2(46.79,36.33) v2(46.79,31.25) v2(46.79,26.17) v2(46.79,21.09) v2(53.91,15.8) v2(56.95,36.33) v2(56.95,31.25) v2(56.95,26.17) v2(56.95,21.09) v2(56.95,16.01) v2(62.16,36.3) v2(66.66,6.92) v2(68.03,6.92) v2(72.19,10.93) v2(73.78,36.3) v2(73.91,34.3) v2(74.41,30.3) v2(74.53,26.3) v2(74.78,22.42)
+VSYS: length 24.7
  Top Layer w0.2: R3.1 v1(41.76,23.6) R4.1
  Top Layer w0.275: v1(40.03,26.8) 39.91,26.92 NOT_HDMI.18 39.91,29.88 v1(39.96,29.94)
  Top Layer w0.6: v1(52.8,21.76) 53.56,21.76 v1(54.32,21.76) ; Q1.2 73.83,19.88 74.28,19.42 D1.1 ; 55.76,20.1 55.54,19.88 C5.2 54.36,19.88 v1(54.32,19.84) ; 52.8,19.84 53.56,19.85 54.32,19.84
  Top Layer w0.8: v1(73.41,20.55) 73.41,20.27 Q1.2 ; Q1.2 72.78,20.11 v1(72.78,20.55) ; Q1.2 74.33,19.88 v1(74.78,19.42) v1(74.78,16.92) 74.28,16.42 D1.1 74.28,19.42
  vias: v1(52.8,19.84) v1(55.77,20.11) v1(74.78,18.8) v1(74.78,18.17) v1(74.78,17.55)
A_BCLK: length 50.7
  Top Layer w0.2: 31.79,10.65 30.85,9.71 v1(30.82,9.71)
  Top Layer w0.275: FPC1.17 61.4,16.17 61.15,15.92 v1(61.15,15.65)
  Bottom Layer w0.2: v1(30.82,9.71) 29.78,8.67 29.78,5.17 31.78,3.17 58.16,3.17 61.15,6.17 v1(61.15,15.65)
A_LRCK: length 56.7
  Top Layer w0.2: U1.34 30.68,10.67 30.2,10.67 v1(30.03,10.5)
  Top Layer w0.275: FPC1.15 62.4,16.06 62.27,15.92 v1(62.27,15.65)
  Bottom Layer w0.2: v1(62.27,15.65) 62.27,4.79 59.41,1.92 30.53,1.92 28.53,3.92 28.53,9 v1(30.03,10.5)
A_SDAT: length 53.7
  Top Layer w0.2: U1.35 30.84,10.27 30.59,10.27 30.43,10.11
  Top Layer w0.275: FPC1.16 61.9,16.12 61.71,15.92 v1(61.71,15.65)
  Bottom Layer w0.2: v1(30.43,10.11) 29.16,8.84 29.16,4.55 31.16,2.55 58.78,2.55 61.71,5.48 v1(61.71,15.65)
CEC: length 15.3
  Top Layer w0.2: 38.36,23.62 38.36,22.42 38.47,22.3 38.47,21.73 v1(38.66,21.55) ; v1(31.25,12.58) 31.19,12.52 30.83,12.52 30.37,12.06
  Bottom Layer w0.2: v1(38.66,21.55) 36.53,19.42 36.53,17.92 31.25,12.65 v1(31.25,12.58)
CK_N: length 4.2
  Top Layer w0.131: 36.41,24.55 36.29,24.67 36.29,24.91 36.52,25.15 36.52,26.62 36.91,27 36.91,28.42
CK_P: length 4.2
  Top Layer w0.131: 35.91,24.55 36.05,24.69 36.05,25.03 36.29,25.26 36.29,26.62 35.91,27 35.91,28.42
CON: length 41.4
  Top Layer w0.2: v1(32.01,8.56) 32.11,8.66 32.11,9.27 32.64,9.8
  Top Layer w0.275: v1(58.94,15.65) 58.9,15.69 FPC1.22
  Bottom Layer w0.2: v1(58.94,15.65) 58.94,8.21 55.78,5.05 33.66,5.05 31.66,7.05 31.66,8.2 v1(32.01,8.56)
D0_N: length 4.2
  Top Layer w0.131: NOT_HDMI.9 35.41,26.92 35.05,26.56 35.05,25.38 35.29,25.15 35.29,24.67 35.41,24.55
D0_P: length 4.2
  Top Layer w0.131: 34.9,24.55 35.05,24.67 35.05,25.03 34.81,25.26 34.81,26.56 34.41,26.97 34.41,28.42
D1_N: length 4.2
  Top Layer w0.131: NOT_HDMI.6 33.91,26.95 33.52,26.56 33.52,25.2 33.28,24.97 33.28,24.67 33.41,24.55
D1_P: length 4.2
  Top Layer w0.131: 32.91,24.55 33.05,24.69 33.05,25.09 33.28,25.32 33.28,26.56 32.91,26.94 NOT_HDMI.4
D2_N: length 4.2
  Top Layer w0.131: 32.41,24.55 32.28,24.68 32.28,25.03 32.04,25.26 32.04,26.62 32.41,26.98 NOT_HDMI.3
D2_P: length 4.2
  Top Layer w0.131: 31.41,28.42 31.41,27 31.81,26.6 31.81,25.14 32.04,24.9 32.04,24.67 RN1.4
FLASH_CS: length 11.2
  Top Layer w0.2: U1.56 38.96,12.17 42.53,12.17 43.28,11.42 43.28,10.12 42.7,9.55 42.29,9.55 ; R9.2 R8.1 U2.1
FLASH_SCK: length 2.3
  Top Layer w0.2: U2.6 38.32,10.55 U1.52
FLASH_SD0: length 1.9
  Top Layer w0.2: U2.5 38.39,11.05 U1.53
FLASH_SD1: length 6.8
  Top Layer w0.2: U1.55 38.71,11.86 42.35,11.86 42.91,11.3 42.91,10.3 42.66,10.05 U2.2
FLASH_SD2: length 5.2
  Top Layer w0.2: 37.94,12.06 38.47,11.53 40.95,11.53 41.25,11.23 41.25,10.8 41.5,10.55 42.29,10.55
FLASH_SD3: length 2.7
  Top Layer w0.2: U1.51 38.25,10.05 U2.7
GPIO_28: length 6.9
  Top Layer w0.2: NOREF.7 29.51,5.3 32.47,8.26 32.47,9.07 32.92,9.52
GPIO_29: length 7.1
  Top Layer w0.2: 33.2,9.23 32.8,8.84 32.8,8.07 30.28,5.55 30.28,3.3
NOT_HDMI_13: length 4.3
  Top Layer w0.275: 38.36,24.48 38.36,25.85 37.41,26.8 NOT_HDMI.13
PI_CK_N: length 7.1
  Top Layer w0.131: 35.68,16.8 35.68,16.92 36.29,17.53 36.29,23.26 36.41,23.37 36.41,23.55
PI_CK_P: length 6.9
  Top Layer w0.131: U1.12 35.48,17.08 36.05,17.65 36.05,23.26 35.91,23.41 35.91,23.55
PI_D0_N: length 6.5
  Top Layer w0.131: 35.41,23.55 35.41,23.38 35.29,23.26 35.29,18.66 35.52,18.42 35.52,17.89 35.11,17.48 U1.13
PI_D0_P: length 6.3
  Top Layer w0.131: 34.9,23.55 34.9,23.4 35.05,23.26 35.05,18.54 35.29,18.3 35.29,18.01 34.93,17.65 34.83,17.65
PI_D1_N: length 6.3
  Top Layer w0.131: 33.41,23.55 33.41,23.38 33.28,23.26 33.28,18.6 33.05,18.36 33.05,18.01 33.4,17.65 33.48,17.65
PI_D1_P: length 6.5
  Top Layer w0.131: 32.91,23.55 32.91,23.4 33.05,23.26 33.05,18.72 32.81,18.48 32.81,17.89 33.2,17.5 U1.16
PI_D2_N: length 6.9
  Top Layer w0.131: 32.41,23.55 32.41,23.39 32.28,23.26 32.28,17.59 32.79,17.08 U1.17
PI_D2_P: length 7.1
  Top Layer w0.131: 31.91,23.55 31.91,23.39 32.04,23.26 32.04,17.48 32.64,16.88 32.64,16.8
PIF: length 47.3
  Top Layer w0.2: v1(31.22,9.32) 31.35,9.45 31.35,9.65 U1.37
  Top Layer w0.275: v1(60.06,15.65) 60.06,15.89 59.9,16.05 FPC1.20
  Bottom Layer w0.2: v1(31.22,9.32) 30.41,8.5 30.41,5.67 32.28,3.8 57.03,3.8 60.06,6.83 v1(60.06,15.65)
R9_1: length 9.9
  Top Layer w0.2: BOOT.3 BOOT.4 45.34,5.42 R9.1
RESET: length 44.4
  Top Layer w0.2: v1(31.61,8.95) 31.75,9.09 31.75,9.48 U1.38
  Top Layer w0.275: FPC1.21 59.4,16.05 59.5,15.96 v1(59.5,15.65)
  Bottom Layer w0.2: v1(31.61,8.95) 31.03,8.37 31.03,6.3 32.91,4.42 56.41,4.42 59.5,7.52 v1(59.5,15.65)
RUN_RST: length 5.8
  Top Layer w0.2: 27.36,12.55 27.34,14.05 27.39,14 v1(27.85,14) ; 30.91,14 30.37,14.54
  Bottom Layer w0.2: v1(30.91,14) 27.86,14 v1(27.85,13.99)
SCL: length 24
  Top Layer w0.2: v1(30.86,12.98) 30.72,12.98 30.09,12.34
  Top Layer w0.275: 38.41,28.42 38.41,26.42 39.53,25.3 40.78,25.3 41.11,24.98 41.11,24.48
  Bottom Layer w0.2: 38.41,26.93 38.41,22.8 35.91,20.3 35.91,17.77 31.29,13.14 31.02,13.14 v1(30.86,12.98)
  vias: v1(38.41,26.93)
SDA: length 29.5
  Top Layer w0.2: v1(30.46,13.38) 30.46,13.28 U1.29
  Top Layer w0.275: 38.91,28.42 38.91,26.55 39.53,25.93 41.4,25.93 42.41,24.92 42.41,24.48 ; NOT_HDMI.16 38.91,29.91 v1(38.84,29.97)
  Bottom Layer w0.2: v1(38.84,29.97) 37.28,28.41 37.28,23.3 35.28,21.3 35.28,17.6 31.19,13.51 30.59,13.51 v1(30.46,13.38)
SWCLK: length 33.5
  Top Layer w0.2: U1.24 30.24,15.8 v1(30.16,15.8)
  Bottom Layer w0.2: 4.16,31.34 17.14,18.35 27.61,18.35 v1(30.16,15.8)
SWDIO: length 32.3
  Top Layer w0.2: v1(29.78,15.42) 29.9,15.3 30.18,15.3 U1.25
  Bottom Layer w0.2: v1(29.78,15.42) 27.46,17.75 15.2,17.75 4.16,28.8
UART_RX: length 29.7
  Top Layer w0.2: v1(29.03,14.67) 29.1,14.67 U1.28
  Bottom Layer w0.2: 4.16,23.72 11.37,16.5 27.21,16.5 v1(29.03,14.67)
UART_TX: length 31
  Top Layer w0.2: v1(29.41,15.05) 29.61,14.85 29.61,14.74 U1.27
  Bottom Layer w0.2: v1(29.41,15.05) 27.36,17.1 13.31,17.1 4.16,26.26
USB_D_N: length 33.1
  Top Layer w0.159: 43.09,2.67 43.62,2.67 44.12,3.17 66.02,3.17 68.51,5.66 74.9,5.65
USB_D_P: length 32.2
  Top Layer w0.159: 43.09,3.92 43.63,3.92 44.12,3.43 65.91,3.43 68.41,5.92 73.53,5.92 USB1.3
USB_N: length 11.5
  Top Layer w0.159: R6.1 41.73,3.17 38.91,3.17 37.9,4.18 37.9,7.67 36.19,9.38 36.09,9.38 35.68,9.8
USB_P: length 11.3
  Top Layer w0.159: 39.02,3.44 38.17,4.29 38.17,7.78 36.37,9.58 36.37,9.67 35.96,10.08 ; R5.1 41.73,3.43 39.02,3.43
VID_CLK: length 60.2
  Top Layer w0.2: v1(29.37,11.2) 29.5,11.33 30.2,11.33 U1.32
  Top Layer w0.275: v1(63.39,15.65) FPC1.13
  Bottom Layer w0.2: v1(29.37,11.2) 27.91,9.73 27.91,3.3 29.91,1.3 60.28,1.3 63.39,4.41 v1(63.39,15.65)
VID_D0: length 40.1
  Top Layer w0.2: 67.41,17 67.41,10.43 64.9,7.92 48.91,7.92 41.78,15.05 39.02,15.05 U1.2
VID_D1: length 39.1
  Top Layer w0.2: 37.94,14.54 38.95,15.55 42.53,15.55 49.41,8.67 64.4,8.67 66.91,11.18 66.91,17
VID_D2: length 38
  Top Layer w0.2: U1.4 38.89,16.05 43.41,16.05 50.03,9.43 63.78,9.43 66.41,12.05 66.41,17
VID_D3: length 37.1
  Top Layer w0.2: U1.5 38.82,16.55 44.16,16.55 50.53,10.18 63.28,10.18 65.91,12.8 65.91,17
VID_D4: length 36.2
  Top Layer w0.2: 65.41,17 65.41,13.42 62.91,10.92 51.03,10.92 44.9,17.05 38.76,17.05 37.09,15.38
VID_D5: length 35.1
  Top Layer w0.2: 36.81,15.67 38.69,17.55 45.66,17.55 51.53,11.67 62.28,11.67 64.9,14.3 64.9,17
VID_D6: length 34.1
  Top Layer w0.2: 64.4,17 64.4,15.05 61.78,12.43 52.03,12.43 46.41,18.05 38.62,18.05 36.52,15.95
VID_SYNC: length 33.4
  Top Layer w0.2: 36.24,16.24 38.56,18.55 47.16,18.55 52.53,13.17 61.66,13.17 63.91,15.43 63.91,17
XIN: length 8.9
  Top Layer w0.2: 32.07,16.23 30.28,18.02 30.28,18.67 28.94,20.02 28.94,20.59 X1.1 27.58,21.95 C1.2
XOUT: length 10
  Top Layer w0.2: C2.2 25.5,20.13 X1.3 25.81,19.52 26.35,18.98 29.34,18.98 29.91,18.43 29.91,17.83 31.79,15.95

## Copper pours and planes (outline as drawn; the poured copper is in the pictures)
+3V3 on PowerLayer: 77.66,-0.45 78.53,20.67 55.16,18.8 52.91,18.8 52.41,21.17 49.16,21.3 39.66,41.05 -1.34,38.55 -1.59,-1.2
+5V_N64 on Top Layer: 68.71,17.66 69.6,17.66 69.6,16.28 68.71,16.28
+VBUS on PowerLayer: 72.03,14.8 72.03,-0.2 77.53,-0.33 77.16,15.17
GND on Top Layer: -2.09,39.05 76.66,39.05 78.41,-0.95 -1.84,-1.45
GND on Bottom Layer: -3.59,38.05 48.41,38.8 78.91,38.55 79.66,-1.7 -3.34,-2.2
GND on GNDLayer: 27.07,35.76 29.23,35.76 29.23,34.6 27.07,34.6
GND on GNDLayer: 3.73,34.31 5.69,34.31 5.69,33.45 3.73,33.45
GND on GNDLayer: 73.62,10.38 74.63,10.38 74.63,8.61 73.62,8.61
GND on GNDLayer: 42.78,29.55 43.53,29.55 43.53,26.89 42.78,26.89
GND on GNDLayer: 42.78,36.96 43.53,36.96 43.53,34.8 42.78,34.8
GND on GNDLayer: 42.78,31.46 43.53,31.46 43.53,28.8 42.78,28.8
GND on GNDLayer: 28.28,35.55 29.03,35.55 29.03,33.39 28.28,33.39
GND on GNDLayer: 3.73,34.3 4.58,34.3 4.58,32.35 3.73,32.35
GND on GNDLayer: 28.08,35.76 30.24,35.76 30.24,34.6 28.08,34.6
GND on GNDLayer: 2.62,34.31 4.58,34.31 4.58,33.45 2.62,33.45
GND on GNDLayer: 3.73,35.41 4.58,35.41 4.58,33.46 3.73,33.46
GND on GNDLayer: 28.28,31.46 29.03,31.46 29.03,28.8 28.28,28.8
GND on GNDLayer: 28.28,36.96 29.03,36.96 29.03,34.8 28.28,34.8
GND on GNDLayer: 28.28,29.55 29.03,29.55 29.03,26.89 28.28,26.89
GND on GNDLayer: 41.32,30.01 43.98,30.01 43.98,28.35 41.32,28.35
GND on GNDLayer: 0.1,37.3 76.9,37.3 76.9,0.1 0.1,0.1
GND on GNDLayer: 73.62,3.23 74.63,3.23 74.63,1.46 73.62,1.46
GND on GNDLayer: 41.57,35.76 43.73,35.76 43.73,34.6 41.57,34.6
GND on GNDLayer: 73.62,11.14 74.63,11.14 74.63,9.37 73.62,9.37
GND on GNDLayer: 42.33,30.01 44.99,30.01 44.99,28.35 42.33,28.35
GND on GNDLayer: 27.83,30.01 30.49,30.01 30.49,28.35 27.83,28.35
GND on GNDLayer: 42.78,35.55 43.53,35.55 43.53,33.39 42.78,33.39
GND on GNDLayer: 26.82,30.01 29.48,30.01 29.48,28.35 26.82,28.35
GND on GNDLayer: 73.62,3.99 74.63,3.99 74.63,2.22 73.62,2.22
GND on GNDLayer: 42.58,35.76 44.74,35.76 44.74,34.6 42.58,34.6
GND on PowerLayer: 29.16,11.42 26.91,9.17 26.91,3.42 30.03,0.17 71.91,0.17 71.78,18.17 57.91,18.05 57.91,8.55 55.66,6.17 33.03,6.17 32.03,7.17 32.03,7.92 32.41,8.3
+VSYS on PowerLayer: 71.91,14.67 77.16,14.67 75.16,38.05 39.66,37.8 39.66,26.8 40.28,22.8 45.78,22.67 46.66,20.42 52.28,20.55 52.28,18.17 71.66,18.3

Small or netless copper shapes (teardrops, artwork), in the pictures only: 6 on GNDLayer

## Text on the board
Bottom Silkscreen Layer: 9 | 7 | 8 | 21 | 11 | 10 | 12 | 13 | 15 | 20 | 14 | 19 | 18 | CLK | CEC | CK- | D0- | D1- | D0+ | D1+ | D2- | SCL | D2+ | CK+ | SDA | SYN | DVI GPIO
Document Layer: RF Shield Border / Keep Out
Top Silkscreen Layer: GND | U_TX | U_RX | SWCLK | SWDIO | 28 | 29 | GPIOS | JLCJLCJLCJLC | "There could be an HDMI | port in this very room!" | Do not release the | magic smoke! | WARNING: | github.com/chobrenga | N64 SpyDVI V2.4
